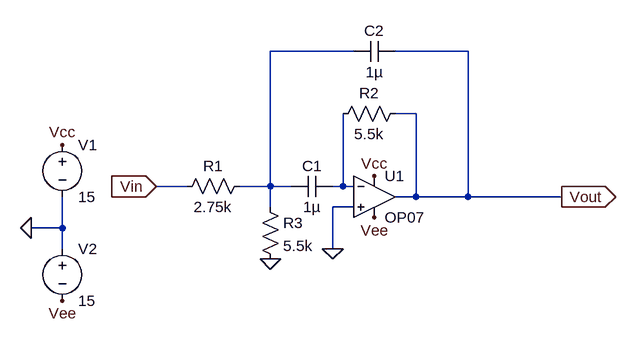
[diagram p0: schematic 50Hz_new.asc]
50Hz_new.asc, the LTspice schematic file:
Version 4.1
SHEET 1 880 680
WIRE 208 -32 80 -32
WIRE 384 -32 272 -32
WIRE 304 64 272 64
WIRE -48 176 -96 176
WIRE 80 176 80 -32
WIRE 80 176 32 176
WIRE 112 176 80 176
WIRE 192 176 192 64
WIRE 192 176 176 176
WIRE 208 176 192 176
WIRE 304 192 304 64
WIRE 304 192 272 192
WIRE 384 192 384 -32
WIRE 384 192 304 192
WIRE 528 192 384 192
WIRE 80 208 80 176
WIRE 208 208 176 208
WIRE -240 240 -240 192
WIRE -240 240 -288 240
WIRE -240 272 -240 240
WIRE 176 272 176 208
FLAG -288 240 0
FLAG -240 112 Vcc
FLAG -240 352 Vee
FLAG 80 288 0
FLAG 176 272 0
FLAG 240 160 Vcc
FLAG 240 224 Vee
FLAG 528 192 Vout
IOPIN 528 192 Out
FLAG -96 176 Vin
IOPIN -96 176 In
SYMBOL OpAmps\\OP07 240 128 R0
SYMATTR InstName U1
SYMBOL voltage -240 96 R0
WINDOW 123 0 0 Left 0
WINDOW 39 0 0 Left 0
SYMATTR InstName V1
SYMATTR Value 15
SYMBOL voltage -240 256 R0
WINDOW 123 0 0 Left 0
WINDOW 39 0 0 Left 0
SYMATTR InstName V2
SYMATTR Value 15
SYMBOL res 48 160 R90
WINDOW 0 0 56 VBottom 2
WINDOW 3 32 56 VTop 2
SYMATTR InstName R1
SYMATTR Value 2.75k
SYMBOL res 176 80 R270
WINDOW 0 32 56 VTop 2
WINDOW 3 0 56 VBottom 2
SYMATTR InstName R2
SYMATTR Value 5.5k
SYMBOL res 64 192 R0
SYMATTR InstName R3
SYMATTR Value 5.5k
SYMBOL cap 176 160 R90
WINDOW 0 0 32 VBottom 2
WINDOW 3 32 32 VTop 2
SYMATTR InstName C1
SYMATTR Value 1µ
SYMBOL cap 272 -48 R90
WINDOW 0 0 32 VBottom 2
WINDOW 3 32 32 VTop 2
SYMATTR InstName C2
SYMATTR Value 1µ

The netlist it stands for:
* 50Hz_new.asc
X§U1 0 N002 Vcc Vee Vout LT1001  ; OP07, pins In+ In- V+ V- OUT
V1 Vcc 0 15
V2 0 Vee 15
R1 N001 Vin 2.75k
R2 N002 Vout 5.5k
R3 N001 0 5.5k
C1 N002 N001 1µ
C2 Vout N001 1µ
.lib LTC.lib
.backanno
.end